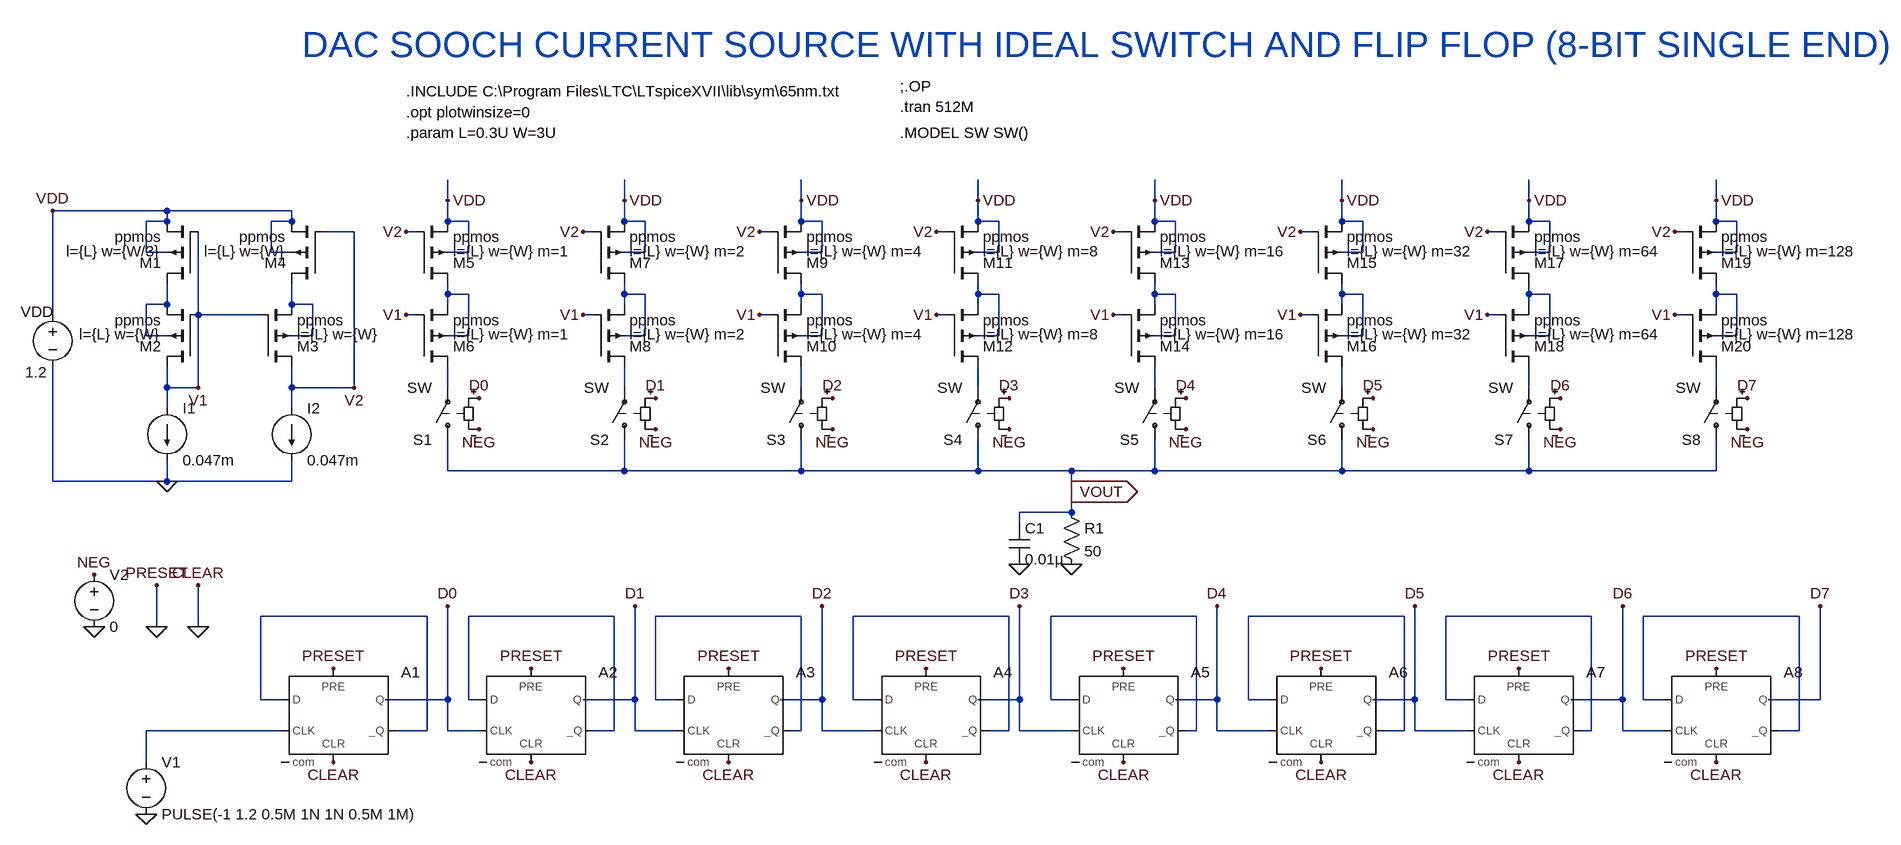
[diagram p0: schematic 103DAC_SOOCH_FF.asc]
103DAC_SOOCH_FF.asc, the LTspice schematic file:
Version 4
SHEET 1 2868 944
WIRE 384 -64 384 -96
WIRE 656 -64 656 -96
WIRE 928 -64 928 -96
WIRE 1200 -64 1200 -96
WIRE 1472 -64 1472 -96
WIRE 1760 -64 1760 -96
WIRE 2048 -64 2048 -96
WIRE 2336 -64 2336 -96
WIRE -48 -48 -224 -48
WIRE 144 -48 -48 -48
WIRE -48 -32 -48 -48
WIRE -48 -32 -80 -32
WIRE 144 -32 144 -48
WIRE 144 -32 112 -32
WIRE 384 -32 384 -64
WIRE 416 -32 384 -32
WIRE 656 -32 656 -64
WIRE 688 -32 656 -32
WIRE 928 -32 928 -64
WIRE 960 -32 928 -32
WIRE 1200 -32 1200 -64
WIRE 1232 -32 1200 -32
WIRE 1472 -32 1472 -64
WIRE 1504 -32 1472 -32
WIRE 1760 -32 1760 -64
WIRE 1792 -32 1760 -32
WIRE 2048 -32 2048 -64
WIRE 2080 -32 2048 -32
WIRE 2336 -32 2336 -64
WIRE 2368 -32 2336 -32
WIRE 240 -16 192 -16
WIRE 336 -16 320 -16
WIRE 608 -16 592 -16
WIRE 880 -16 864 -16
WIRE 1152 -16 1136 -16
WIRE 1424 -16 1408 -16
WIRE 1712 -16 1696 -16
WIRE 2000 -16 1984 -16
WIRE 2288 -16 2272 -16
WIRE -80 16 -80 -32
WIRE -48 16 -80 16
WIRE 112 16 112 -32
WIRE 144 16 112 16
WIRE 416 16 416 -32
WIRE 416 16 384 16
WIRE 688 16 688 -32
WIRE 688 16 656 16
WIRE 960 16 960 -32
WIRE 960 16 928 16
WIRE 1232 16 1232 -32
WIRE 1232 16 1200 16
WIRE 1504 16 1504 -32
WIRE 1504 16 1472 16
WIRE 1792 16 1792 -32
WIRE 1792 16 1760 16
WIRE 2080 16 2080 -32
WIRE 2080 16 2048 16
WIRE 2368 16 2368 -32
WIRE 2368 16 2336 16
WIRE 384 80 384 64
WIRE 416 80 384 80
WIRE 656 80 656 64
WIRE 688 80 656 80
WIRE 928 80 928 64
WIRE 960 80 928 80
WIRE 1200 80 1200 64
WIRE 1232 80 1200 80
WIRE 1472 80 1472 64
WIRE 1504 80 1472 80
WIRE 1760 80 1760 64
WIRE 1792 80 1760 80
WIRE 2048 80 2048 64
WIRE 2080 80 2048 80
WIRE 2336 80 2336 64
WIRE 2368 80 2336 80
WIRE -48 96 -48 64
WIRE -48 96 -80 96
WIRE 144 96 144 64
WIRE 176 96 144 96
WIRE 384 96 384 80
WIRE 656 96 656 80
WIRE 928 96 928 80
WIRE 1200 96 1200 80
WIRE 1472 96 1472 80
WIRE 1760 96 1760 80
WIRE 2048 96 2048 80
WIRE 2336 96 2336 80
WIRE -224 112 -224 -48
WIRE 0 112 0 -16
WIRE 96 112 0 112
WIRE 336 112 320 112
WIRE 608 112 592 112
WIRE 880 112 864 112
WIRE 1152 112 1136 112
WIRE 1424 112 1408 112
WIRE 1712 112 1696 112
WIRE 2000 112 1984 112
WIRE 2288 112 2272 112
WIRE -80 144 -80 96
WIRE -48 144 -80 144
WIRE 176 144 176 96
WIRE 176 144 144 144
WIRE 416 144 416 80
WIRE 416 144 384 144
WIRE 688 144 688 80
WIRE 688 144 656 144
WIRE 960 144 960 80
WIRE 960 144 928 144
WIRE 1232 144 1232 80
WIRE 1232 144 1200 144
WIRE 1504 144 1504 80
WIRE 1504 144 1472 144
WIRE 1792 144 1792 80
WIRE 1792 144 1760 144
WIRE 2080 144 2080 80
WIRE 2080 144 2048 144
WIRE 2368 144 2368 80
WIRE 2368 144 2336 144
WIRE -48 224 -48 192
WIRE 0 224 0 112
WIRE 0 224 -48 224
WIRE 144 224 144 192
WIRE 240 224 240 -16
WIRE 240 224 144 224
WIRE 384 224 384 192
WIRE 656 224 656 192
WIRE 928 224 928 192
WIRE 1200 224 1200 192
WIRE 1472 224 1472 192
WIRE 1760 224 1760 192
WIRE 2048 224 2048 192
WIRE 2336 224 2336 192
WIRE -48 256 -48 224
WIRE 144 256 144 224
WIRE 384 352 384 304
WIRE 656 352 656 304
WIRE 656 352 384 352
WIRE 928 352 928 304
WIRE 928 352 656 352
WIRE 1200 352 1200 304
WIRE 1200 352 928 352
WIRE 1344 352 1200 352
WIRE 1472 352 1472 304
WIRE 1472 352 1344 352
WIRE 1760 352 1760 304
WIRE 1760 352 1472 352
WIRE 2048 352 2048 304
WIRE 2048 352 1760 352
WIRE 2336 352 2336 304
WIRE 2336 352 2048 352
WIRE -224 368 -224 192
WIRE -48 368 -48 336
WIRE -48 368 -224 368
WIRE 144 368 144 336
WIRE 144 368 -48 368
WIRE 1344 384 1344 352
WIRE 1344 416 1344 384
WIRE 1344 416 1264 416
WIRE 1264 432 1264 416
WIRE 352 576 96 576
WIRE 640 576 416 576
WIRE 928 576 704 576
WIRE 1248 576 1008 576
WIRE 1536 576 1312 576
WIRE 1856 576 1616 576
WIRE 2144 576 1920 576
WIRE 2464 576 2224 576
WIRE -64 592 -64 528
WIRE 0 592 0 528
WIRE 96 704 96 576
WIRE 128 704 96 704
WIRE 384 704 384 560
WIRE 384 704 288 704
WIRE 416 704 416 576
WIRE 432 704 416 704
WIRE 672 704 672 560
WIRE 672 704 592 704
WIRE 704 704 704 576
WIRE 736 704 704 704
WIRE 960 704 960 560
WIRE 960 704 896 704
WIRE 1008 704 1008 576
WIRE 1040 704 1008 704
WIRE 1264 704 1264 560
WIRE 1264 704 1200 704
WIRE 1312 704 1312 576
WIRE 1344 704 1312 704
WIRE 1568 704 1568 560
WIRE 1568 704 1504 704
WIRE 1616 704 1616 576
WIRE 1648 704 1616 704
WIRE 1872 704 1872 560
WIRE 1872 704 1808 704
WIRE 1920 704 1920 576
WIRE 1952 704 1920 704
WIRE 2192 704 2192 560
WIRE 2192 704 2112 704
WIRE 2224 704 2224 576
WIRE 2256 704 2224 704
WIRE 2496 704 2496 560
WIRE 2496 704 2416 704
WIRE 128 752 -80 752
WIRE 352 752 352 576
WIRE 352 752 304 752
WIRE 384 752 384 704
WIRE 432 752 384 752
WIRE 640 752 640 576
WIRE 640 752 608 752
WIRE 672 752 672 704
WIRE 736 752 672 752
WIRE 928 752 928 576
WIRE 928 752 912 752
WIRE 960 752 960 704
WIRE 1040 752 960 752
WIRE 1248 752 1248 576
WIRE 1248 752 1216 752
WIRE 1264 752 1264 704
WIRE 1344 752 1264 752
WIRE 1536 752 1536 576
WIRE 1536 752 1520 752
WIRE 1568 752 1568 704
WIRE 1648 752 1568 752
WIRE 1856 752 1856 576
WIRE 1856 752 1824 752
WIRE 1872 752 1872 704
WIRE 1952 752 1872 752
WIRE 2144 752 2144 576
WIRE 2144 752 2128 752
WIRE 2192 752 2192 704
WIRE 2256 752 2192 752
WIRE 2464 752 2464 576
WIRE 2464 752 2432 752
WIRE -80 800 -80 752
FLAG 0 224 V1
FLAG 320 112 V1
FLAG 240 224 V2
FLAG 320 -16 V2
FLAG 384 -64 VDD
FLAG -224 -48 VDD
FLAG 592 112 V1
FLAG 592 -16 V2
FLAG 656 -64 VDD
FLAG 864 112 V1
FLAG 864 -16 V2
FLAG 928 -64 VDD
FLAG 1136 112 V1
FLAG 1136 -16 V2
FLAG 1200 -64 VDD
FLAG 1408 112 V1
FLAG 1408 -16 V2
FLAG 1472 -64 VDD
FLAG 1696 112 V1
FLAG 1696 -16 V2
FLAG 1760 -64 VDD
FLAG 1984 112 V1
FLAG 1984 -16 V2
FLAG 2048 -64 VDD
FLAG 2272 112 V1
FLAG 2272 -16 V2
FLAG 2336 -64 VDD
FLAG 384 560 D0
FLAG 672 560 D1
FLAG 960 560 D2
FLAG 1264 560 D3
FLAG 1568 560 D4
FLAG 1872 560 D5
FLAG 2192 560 D6
FLAG 2496 560 D7
FLAG -80 880 0
FLAG 1344 496 0
FLAG 432 240 D0
FLAG 704 240 D1
FLAG 976 240 D2
FLAG 1248 240 D3
FLAG 1520 240 D4
FLAG 1808 240 D5
FLAG 2096 240 D6
FLAG 2384 240 D7
FLAG 208 656 PRESET
FLAG 512 656 PRESET
FLAG 816 656 PRESET
FLAG 1120 656 PRESET
FLAG 1424 656 PRESET
FLAG 1728 656 PRESET
FLAG 2032 656 PRESET
FLAG 2336 656 PRESET
FLAG -64 528 PRESET
FLAG 208 800 CLEAR
FLAG 512 800 CLEAR
FLAG 816 800 CLEAR
FLAG 1120 800 CLEAR
FLAG 1424 800 CLEAR
FLAG 1728 800 CLEAR
FLAG 2032 800 CLEAR
FLAG 2336 800 CLEAR
FLAG 0 528 CLEAR
FLAG 0 592 0
FLAG -64 592 0
FLAG -48 368 0
FLAG 1344 384 VOUT
IOPIN 1344 384 Out
FLAG 1264 496 0
FLAG -160 512 NEG
FLAG -160 592 0
FLAG 704 288 NEG
FLAG 976 288 NEG
FLAG 1248 288 NEG
FLAG 1520 288 NEG
FLAG 1808 288 NEG
FLAG 2096 288 NEG
FLAG 2384 288 NEG
FLAG 432 288 NEG
SYMBOL pmos4 0 64 R180
WINDOW 123 56 50 Left 2
SYMATTR Value2 l={L} w={W/3}
SYMATTR InstName M1
SYMATTR Value ppmos
SYMBOL pmos4 0 192 R180
WINDOW 123 56 50 Left 2
SYMATTR Value2 l={L} w={W}
SYMATTR InstName M2
SYMATTR Value ppmos
SYMBOL current -48 256 R0
WINDOW 123 0 0 Left 0
WINDOW 39 0 0 Left 0
SYMATTR InstName I1
SYMATTR Value 0.047m
SYMBOL pmos4 96 192 M180
WINDOW 123 56 50 Left 2
SYMATTR Value2 l={L} w={W}
SYMATTR InstName M3
SYMATTR Value ppmos
SYMBOL pmos4 192 64 R180
WINDOW 123 56 50 Left 2
SYMATTR Value2 l={L} w={W}
SYMATTR InstName M4
SYMATTR Value ppmos
SYMBOL current 144 256 R0
WINDOW 123 0 0 Left 0
WINDOW 39 0 0 Left 0
SYMATTR InstName I2
SYMATTR Value 0.047m
SYMBOL pmos4 336 64 M180
WINDOW 123 56 50 Left 2
SYMATTR Value2 l={L} w={W} m=1
SYMATTR InstName M5
SYMATTR Value ppmos
SYMBOL pmos4 336 192 M180
WINDOW 123 56 50 Left 2
SYMATTR Value2 l={L} w={W} m=1
SYMATTR InstName M6
SYMATTR Value ppmos
SYMBOL voltage -224 96 R0
WINDOW 123 0 0 Left 0
WINDOW 39 0 0 Left 0
WINDOW 0 -49 11 Left 2
WINDOW 3 -42 104 Left 2
SYMATTR InstName VDD
SYMATTR Value 1.2
SYMBOL pmos4 608 64 M180
WINDOW 123 56 50 Left 2
SYMATTR Value2 l={L} w={W} m=2
SYMATTR InstName M7
SYMATTR Value ppmos
SYMBOL pmos4 608 192 M180
WINDOW 123 56 50 Left 2
SYMATTR Value2 l={L} w={W} m=2
SYMATTR InstName M8
SYMATTR Value ppmos
SYMBOL pmos4 880 64 M180
WINDOW 123 56 50 Left 2
SYMATTR Value2 l={L} w={W} m=4
SYMATTR InstName M9
SYMATTR Value ppmos
SYMBOL pmos4 880 192 M180
WINDOW 123 56 50 Left 2
SYMATTR Value2 l={L} w={W} m=4
SYMATTR InstName M10
SYMATTR Value ppmos
SYMBOL pmos4 1152 64 M180
WINDOW 123 56 50 Left 2
SYMATTR Value2 l={L} w={W} m=8
SYMATTR InstName M11
SYMATTR Value ppmos
SYMBOL pmos4 1152 192 M180
WINDOW 123 56 50 Left 2
SYMATTR Value2 l={L} w={W} m=8
SYMATTR InstName M12
SYMATTR Value ppmos
SYMBOL pmos4 1424 64 M180
WINDOW 123 56 50 Left 2
SYMATTR Value2 l={L} w={W} m=16
SYMATTR InstName M13
SYMATTR Value ppmos
SYMBOL pmos4 1424 192 M180
WINDOW 123 56 50 Left 2
SYMATTR Value2 l={L} w={W} m=16
SYMATTR InstName M14
SYMATTR Value ppmos
SYMBOL pmos4 1712 64 M180
WINDOW 123 56 50 Left 2
SYMATTR Value2 l={L} w={W} m=32
SYMATTR InstName M15
SYMATTR Value ppmos
SYMBOL pmos4 1712 192 M180
WINDOW 123 56 50 Left 2
SYMATTR Value2 l={L} w={W} m=32
SYMATTR InstName M16
SYMATTR Value ppmos
SYMBOL pmos4 2000 64 M180
WINDOW 123 56 50 Left 2
SYMATTR Value2 l={L} w={W} m=64
SYMATTR InstName M17
SYMATTR Value ppmos
SYMBOL pmos4 2000 192 M180
WINDOW 123 56 50 Left 2
SYMATTR Value2 l={L} w={W} m=64
SYMATTR InstName M18
SYMATTR Value ppmos
SYMBOL pmos4 2288 64 M180
WINDOW 123 56 50 Left 2
SYMATTR Value2 l={L} w={W} m=128
SYMATTR InstName M19
SYMATTR Value ppmos
SYMBOL pmos4 2288 192 M180
WINDOW 123 56 50 Left 2
SYMATTR Value2 l={L} w={W} m=128
SYMATTR InstName M20
SYMATTR Value ppmos
SYMBOL res 1328 400 R0
SYMATTR InstName R1
SYMATTR Value 50
SYMBOL Digital\\dflop 208 656 R0
SYMATTR InstName A1
SYMBOL Digital\\dflop 512 656 R0
SYMATTR InstName A2
SYMBOL Digital\\dflop 816 656 R0
SYMATTR InstName A3
SYMBOL Digital\\dflop 1120 656 R0
SYMATTR InstName A4
SYMBOL Digital\\dflop 1424 656 R0
SYMATTR InstName A5
SYMBOL Digital\\dflop 1728 656 R0
SYMATTR InstName A6
SYMBOL Digital\\dflop 2032 656 R0
SYMATTR InstName A7
SYMBOL Digital\\dflop 2336 656 R0
SYMATTR InstName A8
SYMBOL voltage -80 784 R0
WINDOW 123 0 0 Left 0
WINDOW 39 0 0 Left 0
SYMATTR InstName V1
SYMATTR Value PULSE(-1 1.2 0.5M 1N 1N 0.5M 1M)
SYMBOL sw 384 320 R180
SYMATTR InstName S1
SYMBOL sw 656 320 R180
SYMATTR InstName S2
SYMBOL sw 928 320 R180
SYMATTR InstName S3
SYMBOL sw 1200 320 R180
SYMATTR InstName S4
SYMBOL sw 1472 320 R180
SYMATTR InstName S5
SYMBOL sw 1760 320 R180
SYMATTR InstName S6
SYMBOL sw 2048 320 R180
SYMATTR InstName S7
SYMBOL sw 2336 320 R180
SYMATTR InstName S8
SYMBOL cap 1248 432 R0
SYMATTR InstName C1
SYMATTR Value 0.01µ
SYMBOL voltage -160 496 R0
WINDOW 123 0 0 Left 0
WINDOW 39 0 0 Left 0
SYMATTR InstName V2
SYMATTR Value 0
TEXT 320 -232 Left 2 !.INCLUDE C:\\Program Files\\LTC\\LTspiceXVII\\lib\\sym\\65nm.txt
TEXT 320 -200 Left 2 !.opt plotwinsize=0
TEXT 1080 -240 Left 2 !;.OP
TEXT 320 -168 Left 2 !.param L=0.3U W=3U
TEXT 1080 -208 Left 2 !.tran 512M
TEXT 1080 -168 Left 2 !.MODEL SW SW()
TEXT 160 -304 Left 5 ;DAC SOOCH CURRENT SOURCE WITH IDEAL SWITCH AND FLIP FLOP (8-BIT SINGLE END)

The netlist it stands for:
* 103DAC_SOOCH_FF.asc
M1 N009 V1 VDD VDD ppmos l={L} w={W/3}
M2 V1 V1 N009 N009 ppmos l={L} w={W}
I1 V1 0 0.047m
M3 V2 V1 N010 N010 ppmos l={L} w={W}
M4 N010 V2 VDD VDD ppmos l={L} w={W}
I2 V2 0 0.047m
M5 N001 V2 VDD VDD ppmos l={L} w={W} m=1
M6 N011 V1 N001 N001 ppmos l={L} w={W} m=1
VDD VDD 0 1.2
M7 N002 V2 VDD VDD ppmos l={L} w={W} m=2
M8 N012 V1 N002 N002 ppmos l={L} w={W} m=2
M9 N003 V2 VDD VDD ppmos l={L} w={W} m=4
M10 N013 V1 N003 N003 ppmos l={L} w={W} m=4
M11 N004 V2 VDD VDD ppmos l={L} w={W} m=8
M12 N014 V1 N004 N004 ppmos l={L} w={W} m=8
M13 N005 V2 VDD VDD ppmos l={L} w={W} m=16
M14 N015 V1 N005 N005 ppmos l={L} w={W} m=16
M15 N006 V2 VDD VDD ppmos l={L} w={W} m=32
M16 N016 V1 N006 N006 ppmos l={L} w={W} m=32
M17 N007 V2 VDD VDD ppmos l={L} w={W} m=64
M18 N017 V1 N007 N007 ppmos l={L} w={W} m=64
M19 N008 V2 VDD VDD ppmos l={L} w={W} m=128
M20 N018 V1 N008 N008 ppmos l={L} w={W} m=128
R1 VOUT 0 50
A1 N019 0 N027 0 0 N019 D0 0 DFLOP
A2 N020 0 D0 0 0 N020 D1 0 DFLOP
A3 N021 0 D1 0 0 N021 D2 0 DFLOP
A4 N022 0 D2 0 0 N022 D3 0 DFLOP
A5 N023 0 D3 0 0 N023 D4 0 DFLOP
A6 N024 0 D4 0 0 N024 D5 0 DFLOP
A7 N025 0 D5 0 0 N025 D6 0 DFLOP
A8 N026 0 D6 0 0 N026 D7 0 DFLOP
V1 N027 0 PULSE(-1 1.2 0.5M 1N 1N 0.5M 1M)
S1 VOUT N011 D0 NEG SW
S2 VOUT N012 D1 NEG SW
S3 VOUT N013 D2 NEG SW
S4 VOUT N014 D3 NEG SW
S5 VOUT N015 D4 NEG SW
S6 VOUT N016 D5 NEG SW
S7 VOUT N017 D6 NEG SW
S8 VOUT N018 D7 NEG SW
C1 VOUT 0 0.01µ
V2 NEG 0 0
.model NMOS NMOS
.model PMOS PMOS
.lib standard.mos
.INCLUDE C:\Program Files\LTC\LTspiceXVII\lib\sym\65nm.txt
.opt plotwinsize=0
;.OP
.param L=0.3U W=3U
.tran 512M
.MODEL SW SW()
* DAC SOOCH CURRENT SOURCE WITH IDEAL SWITCH AND FLIP FLOP (8-BIT SINGLE END)
.backanno
.end